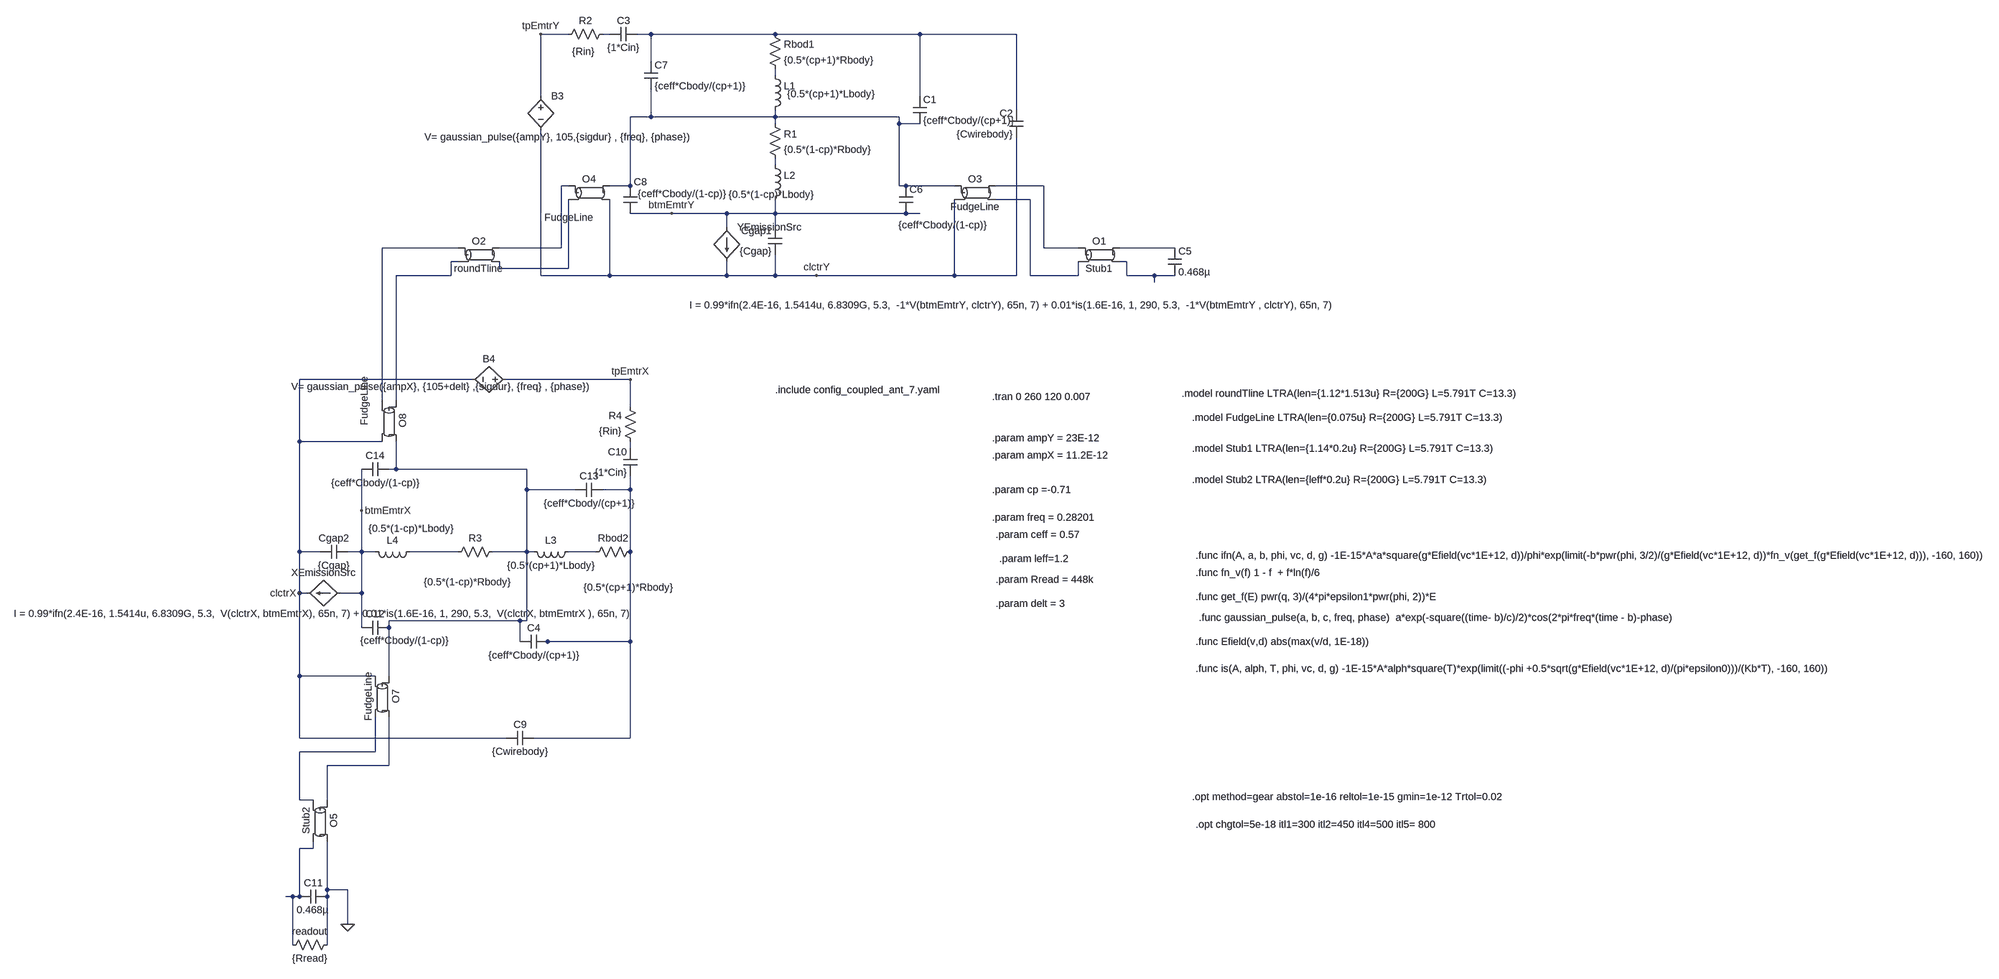
[diagram p0: schematic two_coupled_antennas_with_currents.asc]
two_coupled_antennas_with_currents.asc, the LTspice schematic file:
Version 4.1
SHEET 1 2452 1920
WIRE -1104 -496 -1168 -496
WIRE -1008 -496 -1024 -496
WIRE -912 -496 -944 -496
WIRE -624 -496 -912 -496
WIRE -288 -496 -624 -496
WIRE -64 -496 -288 -496
WIRE -912 -432 -912 -496
WIRE -624 -400 -624 -416
WIRE -1168 -352 -1168 -496
WIRE -288 -352 -288 -496
WIRE -64 -320 -64 -496
WIRE -912 -304 -912 -368
WIRE -912 -304 -960 -304
WIRE -624 -304 -624 -320
WIRE -624 -304 -912 -304
WIRE -336 -304 -624 -304
WIRE -624 -288 -624 -304
WIRE -336 -288 -336 -304
WIRE -288 -288 -336 -288
WIRE -624 -192 -624 -208
WIRE -1104 -144 -1120 -144
WIRE -960 -144 -960 -304
WIRE -960 -144 -1008 -144
WIRE -336 -144 -336 -288
WIRE -320 -144 -336 -144
WIRE -208 -144 -320 -144
WIRE 0 -144 -112 -144
WIRE -960 -128 -960 -144
WIRE -32 -112 -112 -112
WIRE -864 -80 -960 -80
WIRE -736 -80 -864 -80
WIRE -624 -80 -624 -112
WIRE -624 -80 -736 -80
WIRE -320 -80 -624 -80
WIRE -288 -80 -320 -80
WIRE -736 -48 -736 -80
WIRE -624 -48 -624 -80
WIRE -1360 0 -1536 0
WIRE -1120 0 -1120 -144
WIRE -1120 0 -1264 0
WIRE 0 0 0 -144
WIRE 80 0 0 0
WIRE 304 0 176 0
WIRE -1360 32 -1376 32
WIRE 192 32 176 32
WIRE -1264 48 -1264 32
WIRE -1104 48 -1104 -112
WIRE -1104 48 -1264 48
WIRE -1376 64 -1376 32
WIRE -1376 64 -1504 64
WIRE -1168 64 -1168 -272
WIRE -1008 64 -1008 -112
WIRE -1008 64 -1168 64
WIRE -736 64 -736 32
WIRE -736 64 -1008 64
WIRE -624 64 -624 16
WIRE -624 64 -736 64
WIRE -528 64 -624 64
WIRE -208 64 -208 -112
WIRE -208 64 -528 64
WIRE -64 64 -64 -256
WIRE -64 64 -208 64
WIRE -32 64 -32 -112
WIRE 80 64 80 32
WIRE 80 64 -32 64
WIRE 192 64 192 32
WIRE 256 64 192 64
WIRE 304 64 256 64
WIRE 256 80 256 64
WIRE -1328 352 -1728 352
WIRE -960 352 -1248 352
WIRE -1536 400 -1536 0
WIRE -1504 400 -1504 64
WIRE -960 416 -960 352
WIRE -1728 496 -1728 352
WIRE -1536 496 -1728 496
WIRE -960 512 -960 496
WIRE -1504 560 -1504 496
WIRE -1504 560 -1520 560
WIRE -1200 560 -1504 560
WIRE -1200 608 -1200 560
WIRE -1088 608 -1200 608
WIRE -960 608 -960 576
WIRE -960 608 -1024 608
WIRE -1584 656 -1584 560
WIRE -1728 752 -1728 496
WIRE -1680 752 -1728 752
WIRE -1584 752 -1584 656
WIRE -1584 752 -1616 752
WIRE -1552 752 -1584 752
WIRE -1360 752 -1472 752
WIRE -1200 752 -1200 608
WIRE -1200 752 -1280 752
WIRE -1184 752 -1200 752
WIRE -1040 752 -1104 752
WIRE -960 752 -960 608
WIRE -1728 848 -1728 752
WIRE -1712 848 -1728 848
WIRE -1584 848 -1584 752
WIRE -1584 848 -1632 848
WIRE -1216 912 -1520 912
WIRE -1200 912 -1200 752
WIRE -1200 912 -1216 912
WIRE -1584 928 -1584 848
WIRE -1520 928 -1520 912
WIRE -1216 960 -1216 912
WIRE -1152 960 -1168 960
WIRE -960 960 -960 752
WIRE -960 960 -1152 960
WIRE -1728 1040 -1728 848
WIRE -1552 1040 -1728 1040
WIRE -1520 1040 -1520 928
WIRE -1728 1184 -1728 1040
WIRE -1248 1184 -1728 1184
WIRE -960 1184 -960 960
WIRE -960 1184 -1184 1184
WIRE -1552 1216 -1552 1136
WIRE -1552 1216 -1728 1216
WIRE -1520 1248 -1520 1136
WIRE -1520 1248 -1664 1248
WIRE -1728 1328 -1728 1216
WIRE -1696 1328 -1728 1328
WIRE -1664 1328 -1664 1248
WIRE -1696 1440 -1696 1424
WIRE -1696 1440 -1728 1440
WIRE -1664 1536 -1664 1424
WIRE -1616 1536 -1664 1536
WIRE -1744 1552 -1760 1552
WIRE -1728 1552 -1728 1440
WIRE -1728 1552 -1744 1552
WIRE -1664 1552 -1664 1536
WIRE -1616 1616 -1616 1536
WIRE -1744 1664 -1744 1552
WIRE -1664 1664 -1664 1552
FLAG -864 -80 btmEmtrY
FLAG -528 64 clctrY
FLAG -1168 -496 tpEmtrY
FLAG -1584 656 btmEmtrX
FLAG -1728 848 clctrX
FLAG -960 352 tpEmtrX
FLAG -1616 1616 0
SYMBOL cap -304 -352 R0
SYMATTR InstName C1
SYMATTR Value {ceff*Cbody/(cp+1)}
SYMBOL cap -608 16 R180
WINDOW 0 24 56 Left 2
WINDOW 3 24 8 Left 2
SYMATTR InstName Cgap1
SYMATTR Value {Cgap}
SYMBOL cap -48 -256 R180
WINDOW 0 24 56 Left 2
WINDOW 3 24 8 Left 2
SYMATTR InstName C2
SYMATTR Value {Cwirebody}
SYMBOL res -640 -512 R0
SYMATTR InstName Rbod1
SYMATTR Value {0.5*(cp+1)*Rbody}
SYMBOL res -640 -304 R0
SYMATTR InstName R1
SYMATTR Value {0.5*(1-cp)*Rbody}
SYMBOL ind -640 -416 R0
WINDOW 3 44 59 Left 2
SYMATTR Value {0.5*(cp+1)*Lbody}
SYMATTR InstName L1
SYMBOL ind -640 -208 R0
WINDOW 3 -92 84 Left 2
SYMATTR Value {0.5*(1-cp)*Lbody}
SYMATTR InstName L2
SYMBOL res -1008 -512 R90
WINDOW 0 0 56 VBottom 2
WINDOW 3 41 61 VTop 2
SYMATTR InstName R2
SYMATTR Value {Rin}
SYMBOL cap -944 -512 R90
WINDOW 0 0 32 VBottom 2
WINDOW 3 32 32 VTop 2
SYMATTR InstName C3
SYMATTR Value {1*Cin}
SYMBOL ltline 128 16 R0
SYMATTR InstName O1
SYMATTR Value Stub1
SYMBOL ltline -1312 16 R0
SYMATTR InstName O2
SYMATTR Value roundTline
SYMBOL cap 288 0 R0
SYMATTR InstName C5
SYMATTR Value 0.468µ
SYMBOL cap -336 -144 R0
WINDOW 3 -2 91 Left 2
SYMATTR Value {ceff*Cbody/(1-cp)}
SYMATTR InstName C6
SYMBOL cap -928 -432 R0
SYMATTR InstName C7
SYMATTR Value {ceff*Cbody/(cp+1)}
SYMBOL cap -976 -144 R0
WINDOW 0 24 -9 Left 2
WINDOW 3 33 18 Left 2
SYMATTR InstName C8
SYMATTR Value {ceff*Cbody/(1-cp)}
SYMBOL ltline -160 -128 R0
SYMATTR InstName O3
SYMATTR Value FudgeLine
SYMBOL ltline -1056 -128 R0
WINDOW 3 -46 42 Top 2
SYMATTR Value FudgeLine
SYMATTR InstName O4
SYMBOL cap -1152 944 R90
WINDOW 0 0 32 VBottom 2
WINDOW 3 32 32 VTop 2
SYMATTR InstName C4
SYMATTR Value {ceff*Cbody/(cp+1)}
SYMBOL cap -1680 768 R270
WINDOW 0 32 32 VTop 2
WINDOW 3 0 32 VBottom 2
SYMATTR InstName Cgap2
SYMATTR Value {Cgap}
SYMBOL cap -1248 1200 R270
WINDOW 0 32 32 VTop 2
WINDOW 3 0 32 VBottom 2
SYMATTR InstName C9
SYMATTR Value {Cwirebody}
SYMBOL res -944 736 R90
WINDOW 0 0 56 VBottom 2
WINDOW 3 83 21 VTop 2
SYMATTR InstName Rbod2
SYMATTR Value {0.5*(cp+1)*Rbody}
SYMBOL res -1264 736 R90
WINDOW 0 0 56 VBottom 2
WINDOW 3 70 75 VTop 2
SYMATTR InstName R3
SYMATTR Value {0.5*(1-cp)*Rbody}
SYMBOL ind -1088 736 R90
WINDOW 3 32 56 VTop 2
WINDOW 0 5 56 VBottom 2
SYMATTR Value {0.5*(cp+1)*Lbody}
SYMATTR InstName L3
SYMBOL ind -1456 736 R90
WINDOW 3 -54 13 VTop 2
WINDOW 0 5 56 VBottom 2
SYMATTR Value {0.5*(1-cp)*Lbody}
SYMATTR InstName L4
SYMBOL res -944 512 R180
WINDOW 0 36 76 Left 2
WINDOW 3 36 40 Left 2
SYMATTR InstName R4
SYMATTR Value {Rin}
SYMBOL cap -944 576 R180
WINDOW 0 24 56 Left 2
WINDOW 3 24 8 Left 2
SYMATTR InstName C10
SYMATTR Value {1*Cin}
SYMBOL ltline -1680 1376 R90
SYMATTR InstName O5
SYMATTR Value Stub2
SYMBOL cap -1664 1536 R90
WINDOW 0 0 32 VBottom 2
WINDOW 3 31 33 VTop 2
SYMATTR InstName C11
SYMATTR Value 0.468µ
SYMBOL cap -1520 912 R90
WINDOW 3 30 -35 VTop 2
WINDOW 0 0 32 VBottom 2
SYMATTR Value {ceff*Cbody/(1-cp)}
SYMATTR InstName C12
SYMBOL cap -1024 592 R90
WINDOW 0 0 32 VBottom 2
WINDOW 3 32 32 VTop 2
SYMATTR InstName C13
SYMATTR Value {ceff*Cbody/(cp+1)}
SYMBOL cap -1520 544 R90
WINDOW 0 0 32 VBottom 2
WINDOW 3 32 32 VTop 2
SYMATTR InstName C14
SYMATTR Value {ceff*Cbody/(1-cp)}
SYMBOL ltline -1536 1088 R90
SYMATTR InstName O7
SYMATTR Value FudgeLine
SYMBOL ltline -1520 448 R90
WINDOW 3 -46 42 Top 2
SYMATTR Value FudgeLine
SYMATTR InstName O8
SYMBOL bi -736 -48 R0
WINDOW 3 -87 181 Left 2
SYMATTR Value I = 0.99*ifn(2.4E-16, 1.5414u, 6.8309G, 5.3,  -1*V(btmEmtrY, clctrY), 65n, 7) + 0.01*is(1.6E-16, 1, 290, 5.3,  -1*V(btmEmtrY , clctrY), 65n, 7)
SYMATTR InstName YEmissionSrc
SYMBOL bi -1632 848 R90
WINDOW 3 32 40 VTop 2
WINDOW 0 -32 40 VBottom 2
SYMATTR Value I = 0.99*ifn(2.4E-16, 1.5414u, 6.8309G, 5.3,  V(clctrX, btmEmtrX), 65n, 7) + 0.01*is(1.6E-16, 1, 290, 5.3,  V(clctrX, btmEmtrX ), 65n, 7)
SYMATTR InstName XEmissionSrc
SYMBOL bv -1232 352 R90
WINDOW 3 1 167 VTop 2
WINDOW 0 -32 56 VBottom 2
SYMATTR Value V= gaussian_pulse({ampX}, {105+delt} ,{sigdur}, {freq} , {phase})
SYMATTR InstName B4
SYMBOL bv -1168 -368 R0
WINDOW 3 -270 111 Left 2
SYMATTR Value V= gaussian_pulse({ampY}, 105,{sigdur} , {freq}, {phase})
SYMATTR InstName B3
SYMBOL res -1648 1648 R90
WINDOW 0 0 56 VBottom 2
WINDOW 3 32 56 VTop 2
SYMATTR InstName readout
SYMATTR Value {Rread}
TEXT -624 376 Left 2 !.include config_coupled_ant_7.yaml
TEXT -120 392 Left 2 !.tran 0 260 120 0.007
TEXT 344 1320 Left 2 !.opt method=gear abstol=1e-16 reltol=1e-15 gmin=1e-12 Trtol=0.02
TEXT 352 1384 Left 2 !.opt chgtol=5e-18 itl1=300 itl2=450 itl4=500 itl5= 800
TEXT 352 800 Left 2 !.func fn_v(f) 1 - f  + f*ln(f)/6
TEXT 352 856 Left 2 !.func get_f(E) pwr(q, 3)/(4*pi*epsilon1*pwr(phi, 2))*E
TEXT 352 760 Left 2 !.func ifn(A, a, b, phi, vc, d, g) -1E-15*A*a*square(g*Efield(vc*1E+12, d))/phi*exp(limit(-b*pwr(phi, 3/2)/(g*Efield(vc*1E+12, d))*fn_v(get_f(g*Efield(vc*1E+12, d))), -160, 160))
TEXT 360 904 Left 2 !.func gaussian_pulse(a, b, c, freq, phase)  a*exp(-square((time- b)/c)/2)*cos(2*pi*freq*(time - b)-phase)
TEXT 352 960 Left 2 !.func Efield(v,d) abs(max(v/d, 1E-18))\n \n.func is(A, alph, T, phi, vc, d, g) -1E-15*A*alph*square(T)*exp(limit((-phi +0.5*sqrt(g*Efield(vc*1E+12, d)/(pi*epsilon0)))/(Kb*T), -160, 160))
TEXT -120 488 Left 2 !.param ampY = 23E-12
TEXT -120 528 Left 2 !.param ampX = 11.2E-12
TEXT -112 872 Left 2 !.param delt = 3
TEXT -112 816 Left 2 !.param Rread = 448k
TEXT -120 672 Left 2 !.param freq = 0.28201
TEXT -112 712 Left 2 !.param ceff = 0.57
TEXT 320 384 Left 2 !.model roundTline LTRA(len={1.12*1.513u} R={200G} L=5.791T C=13.3)
TEXT 344 440 Left 2 !.model FudgeLine LTRA(len={0.075u} R={200G} L=5.791T C=13.3)
TEXT 344 512 Left 2 !.model Stub1 LTRA(len={1.14*0.2u} R={200G} L=5.791T C=13.3)
TEXT 344 584 Left 2 !.model Stub2 LTRA(len={leff*0.2u} R={200G} L=5.791T C=13.3)
TEXT -120 608 Left 2 !.param cp =-0.71
TEXT -104 768 Left 2 !.param leff=1.2

The netlist it stands for:
* two_coupled_antennas_with_currents.asc
C1 N002 N004 {ceff*Cbody/(cp+1)}
Cgap1 clctrY btmEmtrY {Cgap}
C2 clctrY N002 {Cwirebody}
Rbod1 N002 N003 {0.5*(cp+1)*Rbody}
R1 N004 N005 {0.5*(1-cp)*Rbody}
L1 N003 N004 {0.5*(cp+1)*Lbody}
L2 N005 btmEmtrY {0.5*(1-cp)*Lbody}
R2 N001 tpEmtrY {Rin}
C3 N002 N001 {1*Cin}
O1 N007 N008 N010 N012 Stub1
O2 N009 N011 N006 N013 roundTline
C5 N010 N012 0.468µ
C6 N004 btmEmtrY {ceff*Cbody/(1-cp)}
C7 N002 N004 {ceff*Cbody/(cp+1)}
C8 N004 btmEmtrY {ceff*Cbody/(1-cp)}
O3 N004 clctrY N007 N008 FudgeLine
O4 N006 N013 N004 clctrY FudgeLine
C4 N016 N015 {ceff*Cbody/(cp+1)}
Cgap2 clctrX btmEmtrX {Cgap}
C9 clctrX N016 {Cwirebody}
Rbod2 N016 N018 {0.5*(cp+1)*Rbody}
R3 N015 N017 {0.5*(1-cp)*Rbody}
L3 N018 N015 {0.5*(cp+1)*Lbody}
L4 N017 btmEmtrX {0.5*(1-cp)*Lbody}
R4 N014 tpEmtrX {Rin}
C10 N016 N014 {1*Cin}
O5 N020 N019 0 N021 Stub2
C11 0 N021 0.468µ
C12 N015 btmEmtrX {ceff*Cbody/(1-cp)}
C13 N016 N015 {ceff*Cbody/(cp+1)}
C14 N015 btmEmtrX {ceff*Cbody/(1-cp)}
O7 N015 clctrX N020 N019 FudgeLine
O8 N011 N009 N015 clctrX FudgeLine
B§YEmissionSrc btmEmtrY clctrY I = 0.99*ifn(2.4E-16, 1.5414u, 6.8309G, 5.3,  -1*V(btmEmtrY, clctrY), 65n, 7) + 0.01*is(1.6E-16, 1, 290, 5.3,  -1*V(btmEmtrY , clctrY), 65n, 7)
B§XEmissionSrc btmEmtrX clctrX I = 0.99*ifn(2.4E-16, 1.5414u, 6.8309G, 5.3,  V(clctrX, btmEmtrX), 65n, 7) + 0.01*is(1.6E-16, 1, 290, 5.3,  V(clctrX, btmEmtrX ), 65n, 7)
B4 tpEmtrX clctrX V= gaussian_pulse({ampX}, {105+delt} ,{sigdur}, {freq} , {phase})
B3 tpEmtrY clctrY V= gaussian_pulse({ampY}, 105,{sigdur} , {freq}, {phase})
readout 0 N021 {Rread}
.include config_coupled_ant_7.yaml
.tran 0 260 120 0.007
.opt method=gear abstol=1e-16 reltol=1e-15 gmin=1e-12 Trtol=0.02
.opt chgtol=5e-18 itl1=300 itl2=450 itl4=500 itl5= 800
.func fn_v(f) 1 - f  + f*ln(f)/6
.func get_f(E) pwr(q, 3)/(4*pi*epsilon1*pwr(phi, 2))*E
.func ifn(A, a, b, phi, vc, d, g) -1E-15*A*a*square(g*Efield(vc*1E+12, d))/phi*exp(limit(-b*pwr(phi, 3/2)/(g*Efield(vc*1E+12, d))*fn_v(get_f(g*Efield(vc*1E+12, d))), -160, 160))
.func gaussian_pulse(a, b, c, freq, phase)  a*exp(-square((time- b)/c)/2)*cos(2*pi*freq*(time - b)-phase)
.func Efield(v,d) abs(max(v/d, 1E-18))
.func is(A, alph, T, phi, vc, d, g) -1E-15*A*alph*square(T)*exp(limit((-phi +0.5*sqrt(g*Efield(vc*1E+12, d)/(pi*epsilon0)))/(Kb*T), -160, 160))
.param ampY = 23E-12
.param ampX = 11.2E-12
.param delt = 3
.param Rread = 448k
.param freq = 0.28201
.param ceff = 0.57
.model roundTline LTRA(len={1.12*1.513u} R={200G} L=5.791T C=13.3)
.model FudgeLine LTRA(len={0.075u} R={200G} L=5.791T C=13.3)
.model Stub1 LTRA(len={1.14*0.2u} R={200G} L=5.791T C=13.3)
.model Stub2 LTRA(len={leff*0.2u} R={200G} L=5.791T C=13.3)
.param cp =-0.71
.param leff=1.2
.backanno
.end